# EAGLE design FAL65816_cpua (EAGLE 7.2.0)
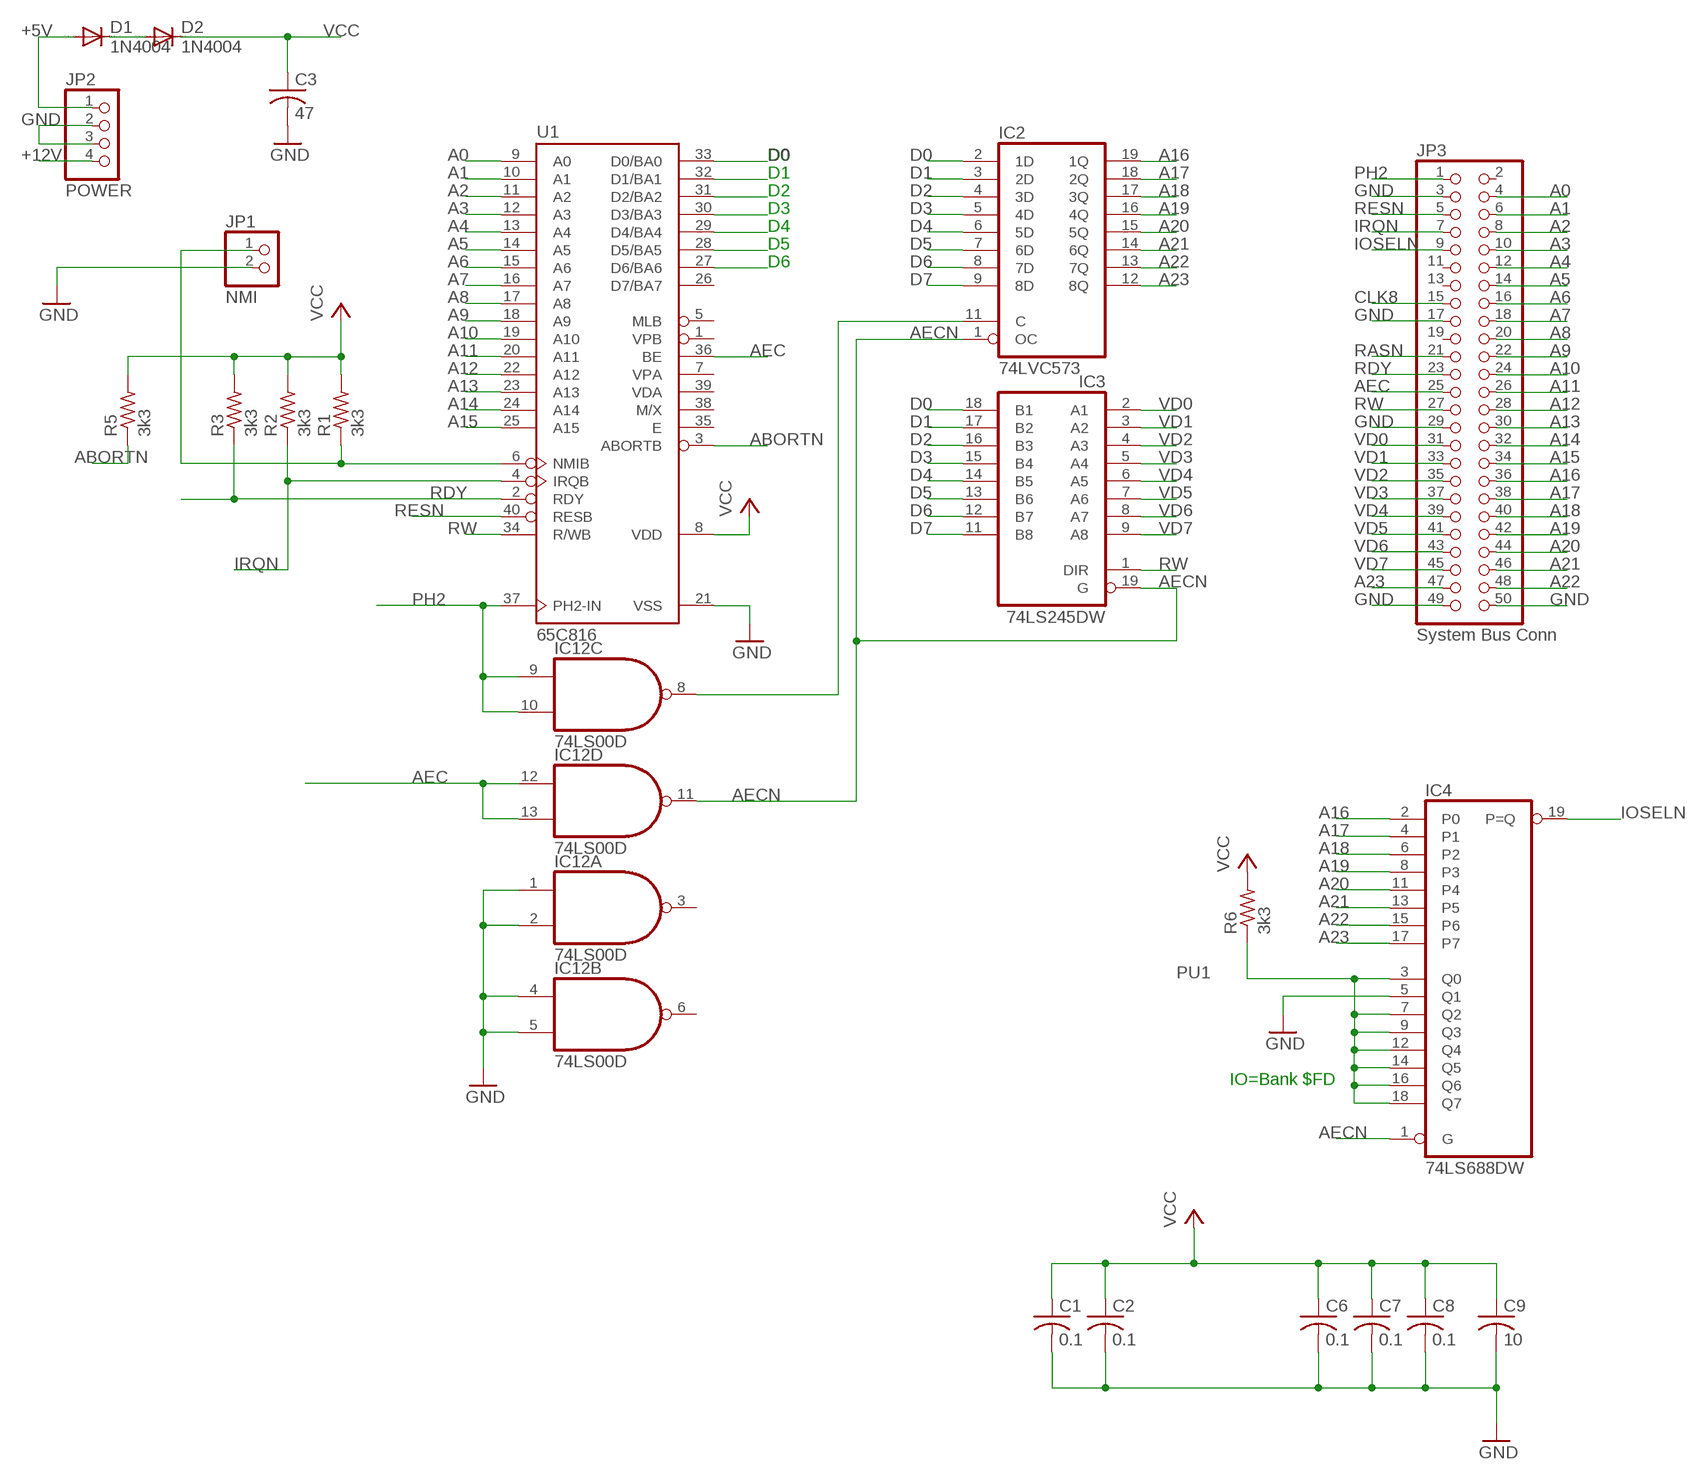
[diagram p0: schematic, sheet 1]

## Parts
C1  0.1  C-US050-024X044  [C050-024X044]
C2  0.1  C-US050-024X044  [C050-024X044]
C3  47  C-US050-024X044  [C050-024X044]
C6  0.1  C-US050-024X044  [C050-024X044]
C7  0.1  C-US050-024X044  [C050-024X044]
C8  0.1  C-US050-024X044  [C050-024X044]
C9  10  C-US050-024X044  [C050-024X044]
D1  1N4004  [DO41-10]
D2  1N4004  [DO41-10]
IC2  74LVC573  [SO20W]
IC3  74LS245DW  [SO20W]
IC4  74LS688DW  [SO20W]
IC12  74LS00D  [SO14]
JP1  NMI  PINHD-1X2  [1X02]
JP2  POWER  PINHD-1X4/90  [1X04/90]
JP3  System Bus Conn  PINHD-2X25/90  [2X25/90]
R1  3k3  R-US_0207/10  [0207/10]
R2  3k3  R-US_0207/10  [0207/10]
R3  3k3  R-US_0207/10  [0207/10]
R5  3k3  R-US_0207/10  [0207/10]
R6  3k3  R-US_0204/7  [0204/7]
U1  65C816  W65C816SP  [DIP-40]

## Nets
+5V: D1.A JP2.1
+12V: JP2.4
A0: JP3.4 U1.9(A0)
A1: JP3.6 U1.10(A1)
A2: JP3.8 U1.11(A2)
A3: JP3.10 U1.12(A3)
A4: JP3.12 U1.13(A4)
A5: JP3.14 U1.14(A5)
A6: JP3.16 U1.15(A6)
A7: JP3.18 U1.16(A7)
A8: JP3.20 U1.17(A8)
A9: JP3.22 U1.18(A9)
A10: JP3.24 U1.19(A10)
A11: JP3.26 U1.20(A11)
A12: JP3.28 U1.22(A12)
A13: JP3.30 U1.23(A13)
A14: JP3.32 U1.24(A14)
A15: JP3.34 U1.25(A15)
A16: IC2.19(1Q) IC4.2(P0) JP3.36
A17: IC2.18(2Q) IC4.4(P1) JP3.38
A18: IC2.17(3Q) IC4.6(P2) JP3.40
A19: IC2.16(4Q) IC4.8(P3) JP3.42
A20: IC2.15(5Q) IC4.11(P4) JP3.44
A21: IC2.14(6Q) IC4.13(P5) JP3.46
A22: IC2.13(7Q) IC4.15(P6) JP3.48
A23: IC2.12(8Q) IC4.17(P7) JP3.47
ABORTN: R5.1 U1.3(ABORTB)
AEC: IC12.12(D:I0) IC12.13(D:I1) JP3.25 U1.36(BE)
AECN: IC2.1(OC) IC3.19(G) IC4.1(G) IC12.11(D:O)
CLK8: JP3.15
D0: IC2.2(1D) IC3.18(B1) U1.33(D0/BA0)
D1: IC2.3(2D) IC3.17(B2) U1.32(D1/BA1)
D2: IC2.4(3D) IC3.16(B3) U1.31(D2/BA2)
D3: IC2.5(4D) IC3.15(B4) U1.30(D3/BA3)
D4: IC2.6(5D) IC3.14(B5) U1.29(D4/BA4)
D5: IC2.7(6D) IC3.13(B6) U1.28(D5/BA5)
D6: IC2.8(7D) IC3.12(B7) U1.27(D6/BA6)
D7: IC2.9(8D) IC3.11(B8)
GND: C1.2 C2.2 C3.2 C6.2 C7.2 C8.2 C9.2 IC4.5(Q1) IC12.1(A:I0) IC12.2(A:I1) IC12.4(B:I0) IC12.5(B:I1) JP1.2 JP2.2 JP2.3 JP3.3 JP3.17 JP3.29 JP3.49 JP3.50 U1.21(VSS)
IOSELN: IC4.19(P=Q) JP3.9
IRQN: JP3.7 R2.1 U1.4(IRQB)
N$1: JP1.1 R1.1 U1.6(NMIB)
N$3: IC2.11(C) IC12.8(C:O)
N$5: D1.C D2.A
PH2: IC12.9(C:I0) IC12.10(C:I1) JP3.1 U1.37(PH2-IN)
PU1: IC4.3(Q0) IC4.7(Q2) IC4.9(Q3) IC4.12(Q4) IC4.14(Q5) IC4.16(Q6) IC4.18(Q7) R6.1
RASN: JP3.21
RDY: JP3.23 R3.1 U1.2(RDY)
RESN: JP3.5 U1.40(RESB)
RW: IC3.1(DIR) JP3.27 U1.34(R/WB)
VCC: C1.1 C2.1 C3.1 C6.1 C7.1 C8.1 C9.1 D2.C R1.2 R2.2 R3.2 R5.2 R6.2 U1.8(VDD)
VD0: IC3.2(A1) JP3.31
VD1: IC3.3(A2) JP3.33
VD2: IC3.4(A3) JP3.35
VD3: IC3.5(A4) JP3.37
VD4: IC3.6(A5) JP3.39
VD5: IC3.7(A6) JP3.41
VD6: IC3.8(A7) JP3.43
VD7: IC3.9(A8) JP3.45
Unconnected: IC12.3(A:O) IC12.6(B:O) JP3.2 JP3.11 JP3.13 JP3.19 U1.1(VPB) U1.5(MLB) U1.7(VPA) U1.26(D7/BA7) U1.35(E) U1.38(M/X) U1.39(VDA)

## Notes on the sheet
- IO=Bank $FD

## Power pins joined to a net without a drawn wire
GND: IC2.10(GND) IC3.10(GND) IC4.10(GND) IC12.7(P:GND)
VCC: IC2.20(VCC) IC3.20(VCC) IC4.20(VCC) IC12.14(P:VCC)

## Library data of the parts
C1-C3 C6-C9 = rcl:C-US: CAPACITOR, American symbol
D1 D2 = diode:1N4004: DIODE general purpose rectifier, 1 A
IC2 = FT74xx:74*573: 8-bit D latch BUS DRIVER
IC3 = FT74xx:74*245: Octal BUS TRANSCEIVER, 3-state
IC4 = FT74xx:74*688: 8-bit MAGNITUDE/IDENTITY COMPARATOR, totem pole
IC12 = 74xx-us:74*00: Quad 2-input NAND gate
JP1 = pinhead:PINHD-1X2: PIN HEADER
JP2 = pinhead:PINHD-1X4: PIN HEADER
JP3 = pinhead:PINHD-2X25: PIN HEADER
R1-R3 R5 R6 = resistor:R-US_: RESISTOR, American symbol
U1 = 65xxx:W65C816SP: Wetern Digital Version

## Board
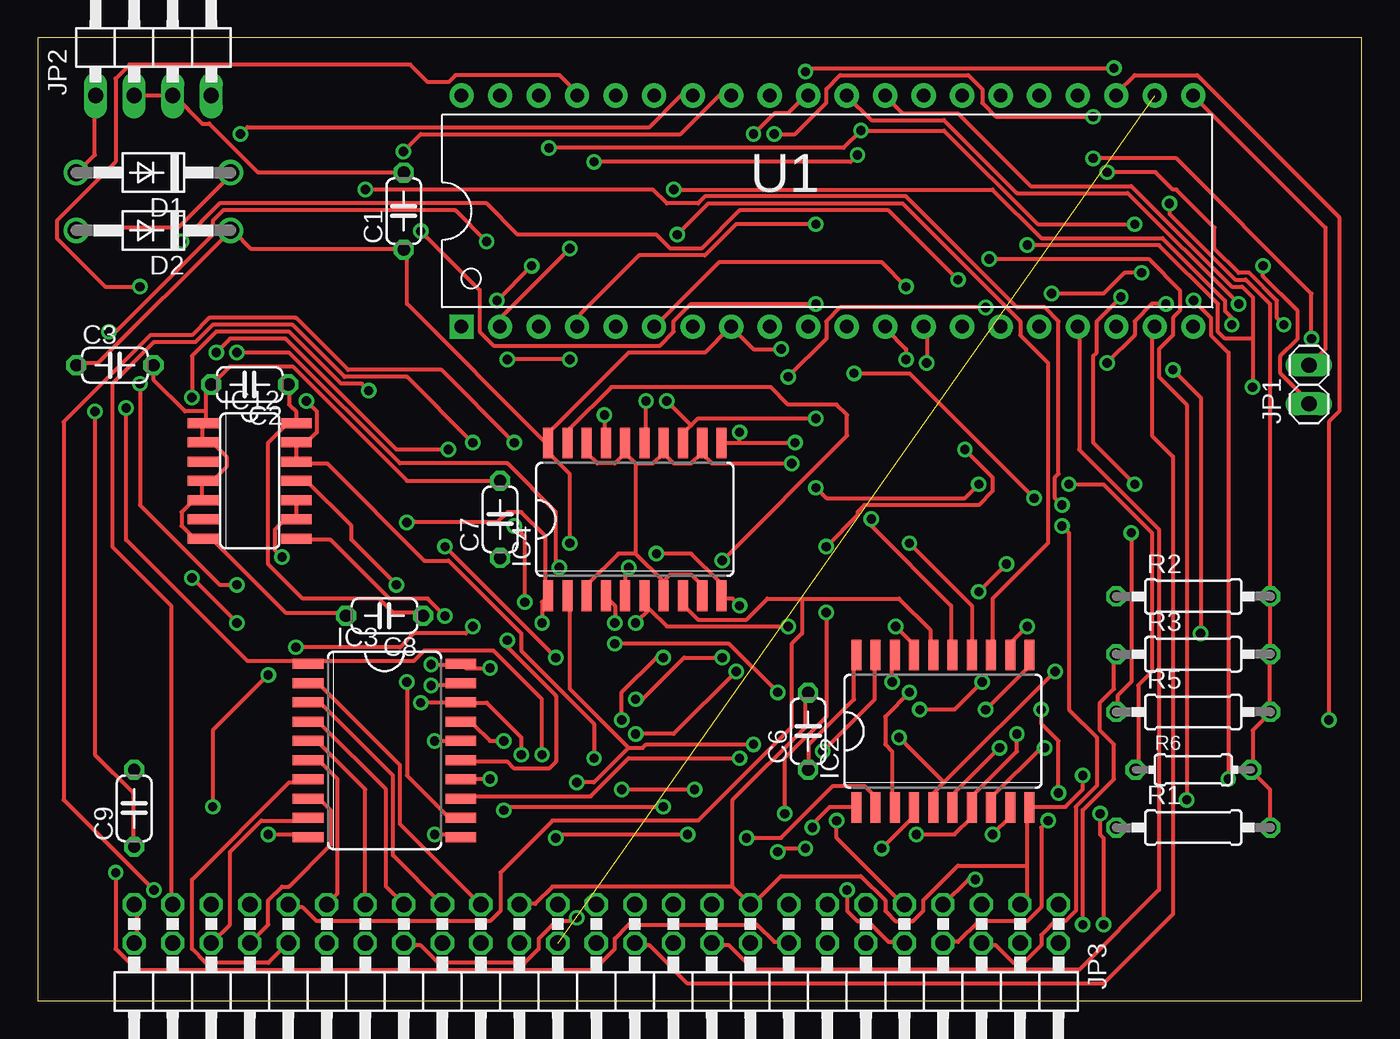
[diagram p1: board, top side]
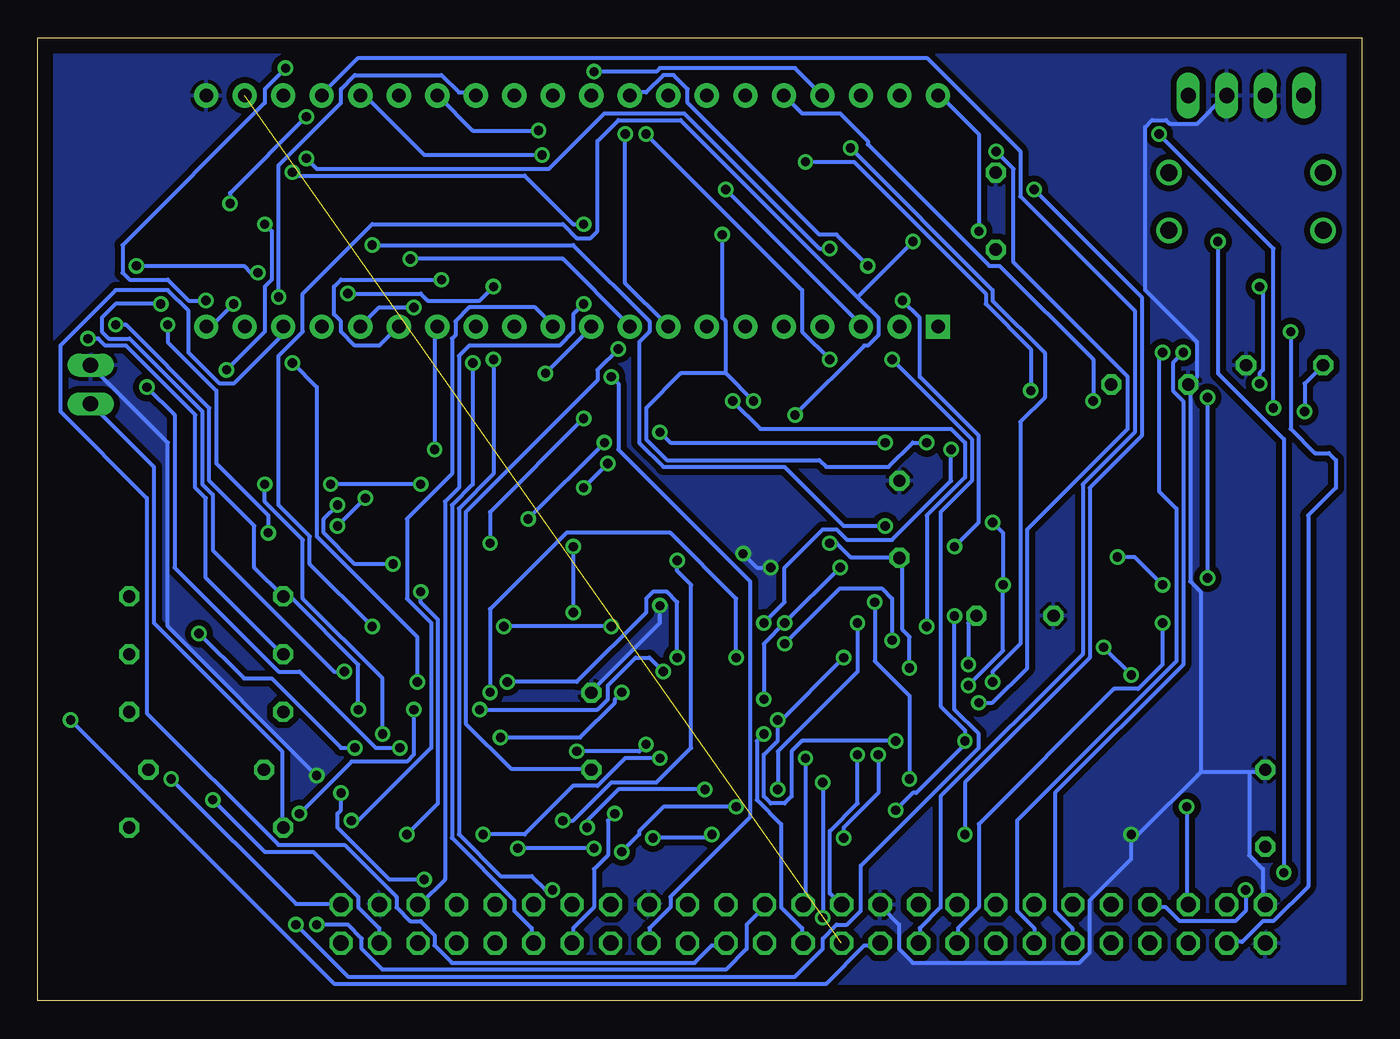
[diagram p2: board, bottom side, seen from below]

Size 87.3 x 63.49 mm. Coordinates in mm from the lower left corner, seen from the top.
Outline: 0,0 87.3,0 87.3,63.49 0,63.49 0,0
Copper layers (1*16): Top 0.035mm / dielectric 1.5mm / Bottom 0.035mm
Design rules "default": minimum track width 10mil, minimum drill 24mil, track to track 8mil, track to pad 8mil, pad to pad 8mil, via to via 8mil, smd to smd 8mil, copper to edge 40mil, drill to drill 8mil, minimum pad ring 10mil, minimum via ring 8mil, stop-mask expansion 4mil, vias tented up to drill 0mil, thermal gap 10mil

### Footprints (pad centres in the part's own frame; a part is rotated, then mirrored left to right if it is on the bottom)
C050-024X044 = drill 0.813 octagon: 1 -2.54,0; 2 2.54,0
DO41-10 = drill 1.118: A 5.08,0; C -5.08,0
SO20W = smd 0.66 x 2.032: 1 -5.715,-5.029; 2 -4.445,-5.029; 3 -3.175,-5.029; 4 -1.905,-5.029; 5 -0.635,-5.029; 6 0.635,-5.029; 7 1.905,-5.029; 8 3.175,-5.029; 9 4.445,-5.029; 10 5.715,-5.029; 11 5.715,5.029; 12 4.445,5.029; 13 3.175,5.029; 14 1.905,5.029; 15 0.635,5.029; 16 -0.635,5.029; 17 -1.905,5.029; 18 -3.175,5.029; 19 -4.445,5.029; 20 -5.715,5.029
SO14 = smd 0.66 x 2.032: 1 -3.81,-3.073; 2 -2.54,-3.073; 3 -1.27,-3.073; 4 0,-3.073; 5 1.27,-3.073; 6 2.54,-3.073; 7 3.81,-3.073; 8 3.81,3.073; 9 2.54,3.073; 10 1.27,3.073; 11 0,3.073; 12 -1.27,3.073; 13 -2.54,3.073; 14 -3.81,3.073
1X02 = drill 1.016 long: 1 -1.27,0; 2 1.27,0
1X04/90 = drill 1.016 long: 1 -3.81,-3.81; 2 -1.27,-3.81; 3 1.27,-3.81; 4 3.81,-3.81
2X25/90 = drill 1.016 octagon: 1 -29.21,-6.35; 2 -29.21,-3.81; 3 -26.67,-6.35; 4 -26.67,-3.81; 5 -24.13,-6.35; 6 -24.13,-3.81; 7 -21.59,-6.35; 8 -21.59,-3.81; 9 -19.05,-6.35; 10 -19.05,-3.81; 11 -16.51,-6.35; 12 -16.51,-3.81; 13 -13.97,-6.35; 14 -13.97,-3.81; 15 -11.43,-6.35; 16 -11.43,-3.81; 17 -8.89,-6.35; 18 -8.89,-3.81; 19 -6.35,-6.35; 20 -6.35,-3.81; 21 -3.81,-6.35; 22 -3.81,-3.81; 23 -1.27,-6.35; 24 -1.27,-3.81; 25 1.27,-6.35; 26 1.27,-3.81; 27 3.81,-6.35; 28 3.81,-3.81; 29 6.35,-6.35; 30 6.35,-3.81; 31 8.89,-6.35; 32 8.89,-3.81; 33 11.43,-6.35; 34 11.43,-3.81; 35 13.97,-6.35; 36 13.97,-3.81; 37 16.51,-6.35; 38 16.51,-3.81; 39 19.05,-6.35; 40 19.05,-3.81; 41 21.59,-3.81; 42 21.59,-6.35; 43 24.13,-3.81; 44 24.13,-6.35; 45 26.67,-3.81; 46 26.67,-6.35; 47 29.21,-3.81; 48 29.21,-6.35; 49 31.75,-3.81; 50 31.75,-6.35
0207/10 = drill 0.813 octagon: 1 -5.08,0; 2 5.08,0
0204/7 = drill 0.813 octagon: 1 -3.81,0; 2 3.81,0
DIP-40 = drill 0.889 pad 1.6 square: 1 -22.86,-7.62 | drill 0.889 pad 1.6: 2 -20.32,-7.62; 3 -17.78,-7.62; 4 -15.24,-7.62; 5 -12.7,-7.62; 6 -10.16,-7.62; 7 -7.62,-7.62; 8 -5.08,-7.62; 9 -2.54,-7.62; 10 0,-7.62; 11 2.54,-7.62; 12 5.08,-7.62; 13 7.62,-7.62; 14 10.16,-7.62; 15 12.7,-7.62; 16 15.24,-7.62; 17 17.78,-7.62; 18 20.32,-7.62; 19 22.86,-7.62; 20 25.4,-7.62; 21 25.4,7.62; 22 22.86,7.62; 23 20.32,7.62; 24 17.78,7.62; 25 15.24,7.62; 26 12.7,7.62; 27 10.16,7.62; 28 7.62,7.62; 29 5.08,7.62; 30 2.54,7.62; 31 0,7.62; 32 -2.54,7.62; 33 -5.08,7.62; 34 -7.62,7.62; 35 -10.16,7.62; 36 -12.7,7.62; 37 -15.24,7.62; 38 -17.78,7.62; 39 -20.32,7.62; 40 -22.86,7.62

### Placement (x,y rotation side)
C1  24.13,52.07 90 top
C2  13.97,40.64 180 top
C3  5.08,41.91 0 top
C6  50.8,17.78 90 top
C7  30.48,31.75 90 top
C8  22.86,25.4 180 top
C9  6.35,12.7 90 top
D1  7.62,54.61 180 top
D2  7.62,50.8 180 top
IC2  59.69,17.78 0 top
IC3  22.86,16.51 270 top
IC4  39.37,31.75 0 top
IC12  13.97,34.29 270 top
JP1  83.82,40.64 90 top
JP2  7.62,63.5 0 top
JP3  38.1,0 180 top
R1  76.2,11.43 0 top
R2  76.2,26.67 0 top
R3  76.2,22.86 0 top
R5  76.2,19.05 0 top
R6  76.2,15.24 0 top
U1  50.8,52.07 0 top

### Tracks (layer width: path | path; a pad name or v marks a point on that pad's centre or on a via)
+5V
  Top 0.254: JP2.1 3.76,59.66 3.76,55.78 2.62,54.63 D1.A
A0  (via drill 0.61)
  Top 0.254: v75.77,13.26 75.77,39.32 73.94,41.15 73.94,42.98 74.85,43.89 74.85,45.03 75.31,45.49 75.31,46.86 73.25,48.92 v62.74,48.92
  Bottom 0.254: v75.77,13.26 72.34,9.83 69.14,9.83 66.17,6.86 66.17,6.17 64.8,4.8 64.8,3.89 JP3.4 | v62.74,48.92 52.68,48.92 48.34,44.58 U1.9
A1  (via drill 0.61)
  Top 0.254: v67.54,31.32 68,30.86 68,19.2 69.83,17.37 69.83,14.17 68.45,12.8 68.45,5.94 67.77,5.26 67.08,5.26 66.17,4.34 66.17,3.66 65.02,2.52 64.34,2.52 63.19,3.66 62.28,3.66 JP3.6 | v65.71,33.15 57.48,41.38 v53.82,41.38
  Bottom 0.254: v65.71,33.15 v67.54,31.32 | v53.82,41.38 50.85,44.35 U1.10
A2  (via drill 0.61)
  Top 0.254: v66.62,11.89 66.17,11.43 66.17,6.17 65.25,5.26 62.05,5.26 60.68,3.89 59.77,3.89 JP3.8
  Bottom 0.254: v66.62,11.89 66.17,11.89 61.37,16.69 61.37,24.92 62.97,26.52 62.97,31.77 59.99,34.75 59.99,43.66 59.77,43.89 59.77,44.81 58.85,45.72 54.51,45.72 53.36,44.58 U1.11
A3  (via drill 0.61)
  Top 0.254: v53.36,7.32 53.36,5.94 54.05,5.26 54.74,5.26 56.11,3.89 57.02,3.89 JP3.10 | v57.25,42.29 57.25,42.98 55.88,44.35 U1.12
  Bottom 0.254: v53.36,7.32 53.82,7.32 54.74,8.23 56.79,8.23 59.54,10.97 59.54,32.46 57.25,34.75 v57.25,42.29
A4  (via drill 0.61)
  Top 0.254: v58.62,42.06 58.62,44.35 U1.13
  Bottom 0.254: v58.62,42.06 58.62,34.06 59.99,32.69 59.99,10.74 55.88,6.63 55.88,5.94 54.74,4.8 54.74,3.89 JP3.12
A5  (via drill 0.61)
  Top 0.254: v49.25,12.34 49.25,16 51.99,18.75 v51.99,25.6 | v51.99,29.95 54.05,32 54.05,32.23 54.51,32.69 62.05,32.69 62.97,33.6 62.97,34.52 v61.14,36.35
  Bottom 0.254: v49.25,12.34 49.71,11.89 49.71,9.6 50.62,8.69 50.62,6.17 51.99,4.8 51.99,3.89 JP3.14 | v51.99,29.95 v51.99,25.6 | v61.14,36.35 61.14,44.35 U1.14
A6  (via drill 0.61)
  Top 0.254: v5.13,8.46 5.13,3.43 6.5,2.06 36.68,2.06 38.05,3.43 38.05,4.12 38.96,5.03 47.42,5.03 48.56,3.89 49.48,3.89 JP3.16 | v9.47,50.06 11.99,52.58 29.59,52.58 31.65,50.52 40.79,50.52 41.71,49.61 43.76,49.61 46.28,52.12 56.11,52.12 v60.68,47.55
  Bottom 0.254: v5.13,8.46 5.13,37.03 9.47,41.38 v9.47,50.06 | v60.68,47.55 67.31,47.55 67.77,47.09 67.77,45.26 67.31,44.81 67.31,44.12 66.4,43.2 64.8,43.2 63.65,44.35 U1.15
A7  (via drill 0.61)
  Top 0.254: v49.48,41.15 51.99,43.66 51.99,44.81 52.91,45.72 v62.51,45.72
  Bottom 0.254: v49.48,41.15 49.02,40.69 49.02,36.35 40.33,27.66 40.33,12.12 45.59,6.86 45.59,6.17 46.97,4.8 46.97,3.89 JP3.18 | v62.51,45.72 64.8,45.72 65.94,44.58 U1.16
A8
  Top 0.254: JP3.20 44.45,3.66 45.59,3.66 47.19,2.06 68.68,2.06 73.94,7.32 73.94,31.09 68.68,36.35 68.68,44.35 U1.17
A9
  Bottom 0.254: JP3.22 41.94,3.66 42.85,3.66 43.99,2.52 59.99,2.52 61.14,3.66 61.14,4.34 62.05,5.26 62.74,5.26 63.65,6.17 63.65,6.86 67.08,10.29 71.42,10.29 80.11,18.97 80.11,33.15 85.83,38.86 85.83,43.2 82.17,46.86 78.74,46.86 77.37,45.49 77.37,42.75 75.31,40.69 74.4,40.69 71.2,43.89 71.2,44.35 U1.18
A10
  Top 0.254: JP3.24 39.42,3.66 40.33,3.66 42.85,1.14 70.28,1.14 74.85,5.71 74.85,35.89 73.48,37.26 73.48,44.35 U1.19
A11  (via drill 0.61)
  Top 0.254: v39.42,17.6 41.94,17.6 v46.05,21.72 | v58.17,19.2 60.45,19.2 v62.28,21.03 | v70.51,42.06 72.34,43.89 72.34,44.81 73.48,45.95 v74.4,45.95
  Bottom 0.254: v39.42,17.6 39.88,17.14 39.88,13.26 38.28,11.66 38.28,6.17 36.91,4.8 36.91,3.89 JP3.26 | v46.05,21.72 46.97,22.63 47.88,22.63 49.71,20.8 49.71,19.89 50.39,19.2 v58.17,19.2 | v62.28,21.03 62.28,24 68.91,30.63 68.91,40.46 v70.51,42.06 | v74.4,45.95 76,44.35 U1.20
A12  (1 unrouted)
A13  (via drill 0.61)
  Top 0.254: v85.14,18.52 85.14,38.18 85.83,38.86 85.83,51.66 76.45,61.04 72.34,61.04 71.2,59.89 U1.23
  Bottom 0.254: v85.14,18.52 67.77,1.14 35.31,1.14 32.79,3.66 31.88,3.66 JP3.30
A14
  Bottom 0.254: JP3.32 29.13,3.89 29.13,4.8 27.76,6.17 27.76,13.49 18.39,22.86 18.39,34.06 14.96,37.49 14.96,45.49 22.5,53.03 22.5,56.01 28.68,62.18 66.17,62.18 68.45,59.89 U1.24
A15  (via drill 0.61)
  Top 0.254: v10.16,27.89 v13.13,24.92 | v10.16,39.78 10.16,42.52 11.76,44.12 16.56,44.12 19.99,40.69 21.36,40.69 v21.82,40.23 | v36.68,55.32 53.59,55.32 v54.05,55.78
  Bottom 0.254: v13.13,24.92 13.13,22.17 14.73,20.57 16.33,20.57 25.25,11.66 25.25,6.17 26.62,4.8 26.62,3.89 JP3.34 | v10.16,39.78 v10.16,27.89 | v21.82,40.23 21.82,42.98 24.79,45.95 24.79,46.63 33.48,55.32 v36.68,55.32 | v54.05,55.78 61.82,55.78 65.94,59.89 U1.25
A16  (via drill 0.61)
  Top 0.254: v51.77,16.46 55.19,19.89 55.19,22.63 IC2.19 | v47.19,16.92 40.11,16.92 39.88,16.69 38.96,16.69 | 38.96,16.69 35.08,20.57 35.08,26.52 IC4.2 | v35.53,5.49 35.31,5.26 34.16,5.26 33.02,4.12 33.02,3.43 32.11,2.52 26.39,2.52 25.25,3.66 24.33,3.66 JP3.36 | v35.53,14.4 36.68,14.4 38.96,16.69
  Bottom 0.254: v51.77,16.46 47.65,16.46 v47.19,16.92 | v35.53,14.4 v35.53,5.49
A17  (via drill 0.61)
  Top 0.254: v56.34,21.03 56.34,22.63 IC2.18 | v45.14,22.63 42.62,22.63 39.88,19.89 v39.42,19.89 | v38.05,24.92 38.05,26.06 37.59,26.52 IC4.4 | v13.13,42.75 16.56,42.75 23.88,35.43 30.96,35.43 34.16,32.23 34.16,28.8 v34.39,28.57
  Bottom 0.254: v56.34,21.03 51.77,21.03 47.19,25.6 47.19,26.52 46.74,26.98 45.82,26.98 45.14,26.29 v45.14,22.63 | v39.42,19.89 39.42,23.55 v38.05,24.92 v34.39,28.57 | JP3.38 21.59,4.8 22.73,5.94 22.73,11.89 12.22,22.4 12.22,32.46 13.36,33.6 13.36,42.52 v13.13,42.75
A18  (via drill 0.61)
  Top 0.254: v56.57,24.69 57.71,23.55 57.71,22.86 IC2.17 | v49.48,24.69 41.48,24.69 40.33,25.83 | 40.33,25.83 40.11,26.06 40.11,26.52 IC4.6 | v11.76,42.75 12.68,43.66 16.33,43.66 23.65,36.35 v27.08,36.35 | 40.33,25.83 v39.42,24.92
  Bottom 0.254: v49.48,24.69 v56.57,24.69 | v11.76,42.75 12.45,42.06 12.45,40.23 11.76,39.55 11.76,22.17 20.22,13.72 20.22,5.94 19.07,4.8 19.07,3.89 JP3.40 | v27.08,36.35 27.08,34.29 30.96,30.4 33.93,30.4 34.62,31.09 35.53,31.09 38.05,28.57 38.05,26.29 v39.42,24.92
A19
  Top 0.254: 50.39,26.52 48.11,26.52 46.74,25.15 43.54,25.15 42.62,26.06 42.62,26.52 IC4.8 | 50.39,26.52 56.79,26.52 58.85,24.46 58.85,22.86 IC2.16 | 50.39,26.52 50.39,24.23 49.71,23.55 49.71,18.06 43.54,11.89 33.93,11.89 30.5,8.46 30.5,5.94 29.82,5.26 18.39,5.26 17.48,6.17 16.56,6.17 JP3.42
A20  (via drill 0.61)
  Top 0.254: v54.97,31.77 54.97,31.32 60.22,26.06 60.22,22.86 IC2.15 | 46.28,36.8 45.14,36.8 IC4.11 | 46.28,36.8 v49.94,36.8 | v7.64,7.32 1.7,13.26 1.7,38.18 7.42,43.89 10.16,43.89 11.3,45.03 17.02,45.03 20.45,41.6 26.62,41.6 v31.42,36.8 | 46.28,36.8 v46.28,37.49
  Bottom 0.254: v49.94,36.8 v54.97,31.77 | v7.64,7.32 7.64,5.94 8.33,5.26 11.99,5.26 12.9,6.17 13.82,6.17 JP3.44 | v31.42,36.8 45.59,36.8 v46.28,37.49
A21  (via drill 0.61)
  Top 0.254: IC2.14 61.59,26.06 v57.48,30.18 | v51.31,38.41 43.54,38.41 43.08,37.95 | 43.08,37.95 42.62,37.49 42.62,36.8 IC4.13 | v11.53,12.8 11.53,17.83 v15.19,21.49 | v17.02,23.32 23.88,23.32 24.79,24.23 28.22,24.23 v28.68,24.69 | 43.08,37.95 v41.48,39.55
  Bottom 0.254: v57.48,30.18 57.48,32.23 v51.31,38.41 | v11.53,12.8 11.53,6.4 JP3.46 | v17.02,23.32 v15.19,21.49 | v28.68,24.69 28.68,32 26.16,34.52 26.16,36.8 27.08,37.72 39.65,37.72 v41.48,39.55
A22  (via drill 0.61)
  Top 0.254: v42.16,50.52 44.22,52.58 57.02,52.58 64.8,44.81 64.8,43.89 66.62,42.06 66.62,30.18 62.97,26.52 62.97,22.86 IC2.13 | v40.11,39.55 40.11,36.8 IC4.15 | v28.68,36.8 24.33,41.15 20.22,41.15 16.79,44.58 11.53,44.58 10.39,43.43 7.64,43.43 4.9,40.69 4.9,29.95 8.79,26.06 8.79,6.4 JP3.48
  Bottom 0.254: v42.16,50.52 42.16,45.03 41.94,44.81 41.94,41.38 | v40.11,39.55 41.94,41.38 | v28.68,36.8 29.59,36.8 31.19,35.2 35.31,35.2 35.76,35.66 45.82,35.66 47.19,37.03 47.19,39.09 44.91,41.38 41.94,41.38
A23  (via drill 0.61)
  Top 0.254: v37.36,38.63 37.36,36.8 IC4.17 | v65.25,24.69 64.34,23.77 64.34,22.86 IC2.12 | v4.67,44.12 5.13,44.12 11.53,50.52 11.53,51.44 12.22,52.12 27.53,52.12 v29.59,50.06
  Bottom 0.254: v37.36,38.63 32.79,43.2 32.56,43.2 31.88,43.89 31.88,45.03 33.25,46.41 | 33.25,46.41 44.91,58.06 49.02,58.06 50.39,56.69 50.39,50.75 50.85,50.29 51.77,50.29 52.68,51.21 65.25,51.21 69.83,46.63 69.83,44.12 71.42,42.52 71.42,32.69 69.37,30.63 69.37,28.8 v65.25,24.69 | v4.67,44.12 4.67,37.72 3.07,36.12 2.16,36.12 1.7,35.66 1.7,33.83 3.53,32 3.53,7.54 5.82,5.26 6.5,5.26 7.87,3.89 8.79,3.89 JP3.47 | 33.25,46.41 v29.59,50.06
ABORTN  (via drill 0.61)
  Top 0.254: v72.11,30.86 72.11,21.03 71.2,20.12 71.2,19.2 R5.1 | v78.74,44.58 78.74,45.03 78.28,45.49 78.28,46.18 74.17,50.29 66.17,50.29 62.97,53.49 v41.94,53.49
  Bottom 0.254: v72.11,30.86 72.11,32 75.54,35.43 75.54,40.23 78.74,43.43 v78.74,44.58 | v41.94,53.49 33.02,44.58 U1.3
AEC  (via drill 0.61)
  Top 0.254: v17.7,39.55 18.39,38.86 18.39,37.49 17.93,37.03 17.25,37.03 IC12.13 17.02,36.8 17.02,35.66 IC12.12 17.25,35.43 19.07,35.43 25.48,29.03 27.08,29.03 31.88,24.23 31.88,23.09 36.68,18.29 v36.68,16
  Bottom 0.254: v17.7,39.55 17.7,42.29 23.88,48.46 24.56,48.46 32.56,56.46 32.56,56.69 34.39,58.52 36.91,58.52 38.05,59.66 U1.36 | v36.68,16 36.68,6.4 JP3.25
AECN  (via drill 0.61)
  Top 0.254: IC12.11 17.7,34.29 20.68,31.32 20.68,30.4 v23.65,27.43 | v25.93,20.8 27.76,20.8 IC3.19 | v51.08,11.43 51.08,11.66 52.22,12.8 53.82,12.8 IC2.1 | v38.51,13.95 v43.31,13.95 | v33.25,24.92 33.25,26.29 33.48,26.52 IC4.1 33.48,26.75 33.48,30.63 31.88,32.23 30.96,32.23 30.28,31.55 v24.33,31.55
  Bottom 0.254: v25.93,20.8 23.65,23.09 v23.65,27.43 23.65,30.86 v24.33,31.55 | v51.08,11.43 51.08,11.89 49.02,13.95 v43.31,13.95 | v38.51,13.95 38.51,16.46 33.25,21.72 v33.25,24.92
D0  (via drill 0.61)
  Top 0.254: v46.74,10.74 49.02,10.74 52.45,14.17 54.51,14.17 55.19,13.49 55.19,12.8 IC2.2 | v42.85,10.97 34.39,10.97 v34.16,10.74 | v31.88,16.23 31.88,17.37 29.59,19.66 27.99,19.66 IC3.18 27.76,19.66 v25.25,19.66 | v24.11,56.01 25.25,57.15 42.39,57.15 44.91,59.66 45.59,59.66 U1.33
  Bottom 0.254: v46.74,10.74 43.08,10.74 v42.85,10.97 | v34.16,10.74 34.16,11.43 31.88,13.72 v31.88,16.23 | v24.11,56.01 22.96,54.86 22.96,48.69 15.42,41.15 15.42,37.72 22.05,31.09 22.05,21.95 24.33,19.66 v25.25,19.66
D1  (via drill 0.61)
  Top 0.254: v57.48,20.34 55.88,18.75 55.88,16.92 56.34,16.46 56.34,12.8 IC2.3 | v41.25,22.63 40.79,22.63 38.51,20.34 v38.51,18.52 | v30.73,17.14 29.82,17.14 28.68,18.29 27.99,18.29 IC3.17 | v30.28,46.18 v32.56,48.46 | v34.16,22.63 v26.85,29.95
  Bottom 0.254: v57.48,20.34 57.48,25.83 52.45,30.86 45.59,30.86 41.25,26.52 v41.25,22.63 | 38.51,18.29 38.51,17.14 39.42,16.23 39.42,13.49 38.96,13.03 38.05,13.03 37.59,13.49 37.59,16.46 36.91,17.14 v30.73,17.14 | v32.56,48.46 34.62,50.52 35.76,50.52 44.45,59.21 44.45,60.12 45.36,61.04 46.05,61.04 47.19,59.89 48.11,59.89 U1.32 | v30.28,46.18 29.13,45.03 29.13,41.15 25.25,37.26 25.25,31.55 v26.85,29.95 | 38.51,18.29 v34.16,22.63 | 38.51,18.29 v38.51,18.52
D2  (via drill 0.61)
  Top 0.254: v26.16,17.14 IC3.16 | v35.08,42.29 v30.96,42.29 | v47.19,57.15 48.56,58.52 49.48,58.52 50.62,59.66 U1.31 | v55.65,10.06 57.71,12.12 57.71,12.57 IC2.4 | v50.62,10.06 49.02,10.06 v48.79,9.83 | v41.25,12.8 30.96,12.8 v30.73,12.57
  Bottom 0.254: v30.96,42.29 25.71,37.03 25.71,34.29 27.76,32.23 27.76,19.43 26.16,17.83 v26.16,17.14 26.16,16.92 29.36,13.72 29.59,13.72 v30.73,12.57 | v35.08,42.29 36.91,44.12 36.91,46.86 v47.19,57.15 | v50.62,10.06 v55.65,10.06 | v48.79,9.83 47.65,10.97 47.65,11.2 46.05,12.8 v41.25,12.8
D3  (via drill 0.61)
  Top 0.254: v67.08,21.72 59.77,14.4 | 59.77,14.4 59.08,13.72 59.08,12.8 IC2.5 | v79.2,45.95 71.88,53.26 64.57,53.26 59.77,58.06 54.97,58.06 U1.30 | v30.96,23.77 30.96,23.32 34.16,20.12 34.16,15.77 33.71,15.32 31.42,15.32 30.96,15.77 27.99,15.77 IC3.15 | v38.05,23.55 45.59,23.55 v48.79,20.34 | 59.77,14.4 v56.79,17.37
  Bottom 0.254: v67.08,21.72 67.77,21.72 75.77,29.72 75.77,33.38 76.45,34.06 76.45,38.86 81.25,43.66 82.63,43.66 83.08,44.12 83.08,45.03 82.17,45.95 v79.2,45.95 | v30.96,23.77 30.96,26.52 31.65,27.2 34.39,27.2 v38.05,23.55 | v48.79,20.34 49.25,19.89 49.25,19.66 51.54,17.37 v56.79,17.37
D4  (via drill 0.61)
  Top 0.254: v63.42,16.69 60.45,13.72 60.45,12.8 IC2.6 | 80.11,43.66 80.11,46.41 79.43,47.09 78.74,47.09 72.11,53.72 65.48,53.72 60.68,58.52 57.02,58.52 55.88,59.66 U1.29 | 80.11,43.66 v80.11,40.46 | v29.82,14.63 27.99,14.63 IC3.14 | v32.11,26.29 32.11,30.63 v31.42,31.32 | v65.25,49.84 73.94,49.84 77.83,45.95 77.83,44.12 78.28,43.66 80.11,43.66
  Bottom 0.254: v63.42,16.69 65.02,16.69 70.05,21.72 71.42,21.72 78.28,28.57 78.28,38.63 v80.11,40.46 | v29.82,14.63 29.82,20.12 32.11,22.4 v32.11,26.29 | v31.42,31.32 34.16,31.32 38.05,35.2 46.05,35.2 47.65,36.8 47.65,43.43 46.97,44.12 46.97,44.81 51.99,49.84 v65.25,49.84
D5  (via drill 0.61)
  Top 0.254: v57.94,10.97 60.45,10.97 61.59,12.12 IC2.7 61.59,13.49 64.57,16.46 v64.57,17.6 | v46.28,16 38.96,16 36.45,13.49 27.99,13.49 IC3.13 | v71.42,46.41 69.83,44.81 69.83,42.75 69.6,42.52 69.6,36.8 v72.34,34.06
  Bottom 0.254: v57.94,10.97 55.19,10.97 51.99,14.17 50.39,14.17 48.56,16 v46.28,16 | v71.42,46.41 71.42,55.09 67.31,59.21 67.31,60.12 66.4,61.04 60.68,61.04 59.54,59.89 58.62,59.89 U1.28 | v72.34,34.06 72.34,32.92 69.83,30.4 69.83,26.52 64.57,21.26 v64.57,17.6
D6  (via drill 0.61)
  Top 0.254: v24.33,21.03 24.33,14.86 27.08,12.12 27.76,12.12 IC3.12 | v33.71,56.24 53.14,56.24 v54.28,57.38 59.77,57.38 65.94,51.21 v72.34,51.21 | v66.4,16.69 66.17,16.69 62.97,13.49 62.97,12.8 IC2.8 | v76.68,24.23 76.68,39.78 v74.85,41.6
  Bottom 0.254: v24.33,21.03 24.33,21.72 22.5,23.55 22.5,38.18 20.9,39.78 20.9,42.75 24.33,46.18 24.33,46.86 v33.71,56.24 | v54.28,57.38 58.62,57.38 60.91,59.66 U1.27 | v66.4,16.69 67.31,16.69 71.88,21.26 73.71,21.26 v76.68,24.23 | v74.85,41.6 72.34,44.12 72.34,47.09 71.88,47.55 71.88,50.75 v72.34,51.21
D7  (via drill 0.61)
  Top 0.254: v26.16,10.97 27.76,10.97 IC3.11 | v21.59,53.49 40.56,53.49 41.48,52.58 43.54,52.58 43.99,53.03 57.25,53.03 64.57,45.72 66.4,45.72 67.31,44.81 67.31,34.75 67.08,34.52 67.08,33.15 v67.54,32.69 | v62.05,26.98 v63.88,28.8 | v62.97,10.97 64.11,12.12 64.11,12.57 IC2.9
  Bottom 0.254: v26.16,10.97 26.16,14.4 17.93,22.63 17.93,33.83 14.5,37.26 14.5,46.41 v21.59,53.49 | v67.54,32.69 68.45,31.77 68.45,30.86 66.4,28.8 v63.88,28.8 | v62.05,26.98 62.05,26.29 60.91,25.15 60.91,13.03 v62.97,10.97
GND  (via drill 0.61)
  Top 0.254: C1.2 24.11,54.63 14.5,54.63 11.3,57.84 10.85,57.84 9.02,59.66 JP2.3 8.79,59.66 6.5,59.66 JP2.2 | JP3.49 6.5,3.89 6.5,6.17 JP3.50 | v15.19,10.97 17.7,10.97 IC3.10 | C8.2 20.22,25.6 16.33,25.6 11.53,30.4 11.07,30.4 IC12.7 10.85,30.63 10.16,30.63 9.47,31.32 9.47,32.23 10.16,32.92 10.85,32.92 IC12.5 10.85,33.15 10.85,34.29 IC12.4 11.53,34.29 12.45,35.2 12.45,35.89 11.53,36.8 11.07,36.8 IC12.2 10.85,37.03 10.85,37.95 IC12.1 11.07,38.18 11.07,38.86 | 11.07,38.86 11.07,40.23 11.3,40.46 C2.2 11.53,40.69 12.68,41.83 16.79,41.83 24.33,34.29 C7.2 | 11.07,38.86 9.7,38.86 7.64,40.92 7.64,41.83 C3.2 | U1.21 84.91,50.98 84.91,42.98 84,42.06 JP1.2 | 65.25,8.91 65.25,6.86 64.8,6.4 JP3.3 | 65.25,8.91 65.25,12.57 IC2.10 65.48,12.8 67.77,12.8 68.91,13.95 v68.91,14.86 | IC4.5 38.73,28.35 v38.96,28.57 | v40.79,29.49 43.08,29.49 44.91,27.66 44.91,26.75 IC4.10 45.14,26.52 45.82,26.52 v46.28,26.06 | 45.82,7.54 45.82,13.26 50.62,18.06 50.62,20.12 C6.2 | 45.82,7.54 46.97,6.4 JP3.17 47.19,6.4 49.02,8.23 54.28,8.23 55.88,6.63 55.88,5.94 56.57,5.26 57.71,5.26 58.39,5.94 58.39,6.63 60.68,8.91 65.25,8.91 | 45.82,7.54 33.93,7.54 32.79,6.4 31.88,6.4 JP3.29
  Bottom 0.254: 10.62,15.09 14.73,10.97 v15.19,10.97 15.19,9.37 17.93,6.63 17.93,3.2 18.62,2.52 29.59,2.52 30.5,3.43 30.5,5.03 31.65,6.17 JP3.29 | 7.42,15.09 6.5,15.09 C9.2 | 7.42,15.09 10.62,15.09 | 7.42,15.09 7.42,9.6 6.5,8.69 6.5,6.4 JP3.50 | 10.62,15.09 10.62,26.98 11.3,27.66 11.3,40.46 C2.2 11.3,40.69 10.85,41.15 10.85,43.43 14.28,46.86 14.28,57.61 13.82,58.06 12.9,58.06 12.68,57.84 10.85,57.84 9.02,59.66 JP2.3 | v38.96,28.57 39.88,28.57 v40.79,29.49 | v46.28,26.06 46.28,24.92 50.85,20.34 C6.2 | v68.91,14.86 78.74,24.69 78.74,36.8 83.77,41.83 JP1.2
  pour Bottom (isolate 0.406): 0,63.5 87.63,63.5 87.63,0 0,0
IOSELN  (via drill 0.61)
  Top 0.254: v45.14,29.03 53.36,37.26 53.36,38.63 52.68,39.32 49.48,39.32 48.34,40.46 37.82,40.46 35.08,37.72 35.08,36.8 IC4.19 | v52.68,11.89 52.68,10.74 57.02,6.4 JP3.9
  Bottom 0.254: v45.14,29.03 45.14,28.35 44.22,27.43 44.22,16.69 46.51,14.4 49.48,14.4 51.99,11.89 v52.68,11.89
IRQN  (via drill 0.61)
  Top 0.254: v66.17,19.2 66.17,18.29 67.31,17.14 v67.31,13.72 | v61.82,8 61.37,8 59.77,6.4 JP3.7 | v51.31,51.21 46.05,51.21 43.99,49.15 39.65,49.15 35.76,45.26 35.76,44.58 U1.4 | v70.51,54.63 73.71,54.63 74.85,53.49 75.08,53.49 77.6,50.98 77.6,49.61 79.2,48.01 79.88,48.01 81.71,46.18 81.71,45.03 v82.17,44.58
  Bottom 0.254: v66.17,19.2 66.17,22.17 70.51,26.52 70.97,26.52 R2.1 73.02,28.57 73.02,31.32 76,34.29 76,39.09 81.48,44.58 v82.17,44.58 | v67.31,13.72 67.31,12.57 67.54,12.34 67.54,11.43 64.11,8 v61.82,8 | v51.31,51.21 51.99,51.21 55.19,54.41 70.28,54.41 v70.51,54.63
N$1  (via drill 0.61)
  Top 0.254: v57.25,47.09 55.65,48.69 44.91,48.69 40.79,44.58 U1.6 | v66.85,46.63 70.28,46.63 71.65,48.01 v72.8,48.01 | v80.8,48.46 80.8,47.78 83.08,45.49 83.08,43.66 81.94,42.52 81.94,41.38 83.77,39.55 JP1.1
  Bottom 0.254: JP1.1 79.65,35.2 79.65,24.92 71.2,16.46 71.2,11.43 R1.1 | v57.25,47.09 58.17,46.18 61.59,46.18 62.05,46.63 v66.85,46.63 | v72.8,48.01 73.25,48.01 73.71,48.46 v80.8,48.46
N$3  (via drill 0.61)
  Top 0.254: v26.85,25.38 25.71,26.52 23.19,26.52 19.3,30.4 17.25,30.4 IC12.8 | v70.28,5.03 70.28,10.74 70.05,10.97 v70.05,12.34 | v62.51,19.2 65.25,21.95 65.25,22.63 IC2.11
  Bottom 0.254: v26.85,25.38 26.85,19.2 25.25,17.6 25.25,16.69 33.02,8.91 33.02,5.94 33.93,5.03 34.62,5.03 35.53,4.12 35.53,3.43 37.36,1.6 66.85,1.6 v70.28,5.03 | v70.05,12.34 66.62,15.77 62.97,15.77 62.51,16.23 v62.51,19.2
N$5
  Top 0.254: D2.A 2.62,50.98 9.25,50.98 12.68,54.41 D1.C
PH2  (via drill 0.61)
  Top 0.254: IC12.10 17.02,32.92 17.02,31.77 IC12.9 17.02,31.55 16.1,31.55 15.65,31.09 15.65,29.72 v16.1,29.26 | v13.13,27.43 11.99,27.43 6.73,32.69 v6.73,40.69 | v6.73,47.09 4.45,47.09 1.25,50.29 1.25,51.44 5.13,55.32 5.13,60.81 6.05,61.72 24.56,61.72 25.71,60.58 27.08,60.58 27.53,61.04 34.39,61.04 35.53,59.89 U1.37 | v78.51,14.63 78.51,42.75 77.37,43.89 77.37,45.03 v76.22,46.18 | v70.97,61.49 50.85,61.49 v50.62,61.27
  Bottom 0.254: v16.1,29.26 14.96,29.26 v13.13,27.43 | v6.73,40.69 6.73,41.38 6.5,41.6 6.5,46.86 v6.73,47.09 | v78.51,14.63 70.28,6.4 67.31,6.4 JP3.1 | v76.22,46.18 77.37,46.18 78.74,47.55 81.25,47.55 81.71,48.01 81.71,49.84 72.34,59.21 72.34,60.12 v70.97,61.49 | v50.62,61.27 46.51,61.27 46.28,61.49 37.36,61.49 U1.37
PU1  (via drill 0.61)
  Top 0.254: 39.42,29.49 38.28,29.49 36.22,27.43 36.22,26.75 IC4.3 | 41.25,27.66 39.42,29.49 | 41.25,27.66 41.25,26.75 IC4.7 41.25,27.66 | 41.25,27.66 41.71,28.12 43.08,28.12 43.76,27.43 43.76,26.75 IC4.9 | 38.73,36.12 38.05,35.43 36.91,35.43 36.22,36.12 36.22,36.58 IC4.18 | 38.73,36.12 IC4.16 38.73,36.58 | 41.25,36.12 41.25,36.58 IC4.14 41.25,36.12 | 41.25,36.12 40.56,35.43 39.42,35.43 | 38.73,36.12 39.42,35.43 | 43.76,36.12 43.76,36.58 IC4.12 43.76,36.12 | 43.76,36.12 43.08,35.43 41.94,35.43 41.25,36.12 | v68,34.06 70.28,34.06 73.48,30.86 73.48,21.72 72.57,20.8 72.57,15.32 R6.1 | v62.05,34.06 61.14,33.15 51.99,33.15 v51.31,33.83 | v49.71,35.43 44.45,35.43 43.76,36.12 | 39.42,35.43 39.42,29.49
  Bottom 0.254: v62.05,34.06 v68,34.06 | v49.71,35.43 v51.31,33.83
RDY  (via drill 0.61)
  Top 0.254: v68.91,5.03 68.91,12.57 70.97,14.63 70.97,16.92 70.05,17.83 70.05,19.66 70.97,20.57 70.97,22.86 R3.1 | v35.08,49.61 30.5,45.03 30.5,44.58 U1.2 | v69.6,55.55 75.08,55.55 84,46.63 v84,43.66
  Bottom 0.254: v68.91,5.03 66.85,5.03 65.94,4.12 65.94,3.43 64.57,2.06 41.94,2.06 40.56,3.43 40.56,5.03 39.42,6.17 JP3.23 | v35.08,49.61 35.76,49.61 44.68,58.52 49.94,58.52 53.59,54.86 68.91,54.86 v69.6,55.55 | v84,43.66 83.31,43.66 82.86,43.2 81.48,43.2 76.91,38.63 76.91,33.83 76.22,33.15 76.22,27.89 71.2,22.86 R3.1
RESN  (via drill 0.61)
  Top 0.254: v51.31,45.95 43.08,45.95 41.94,44.81 41.94,44.12 41.02,43.2 30.05,43.2 29.13,44.12 29.13,46.86 v25.25,50.75
  Bottom 0.254: v51.31,45.95 51.99,45.26 51.99,44.12 52.91,43.2 58.85,43.2 59.54,42.52 59.54,33.83 60.45,32.92 60.45,8 62.05,6.4 JP3.5 | v25.25,50.75 25.25,57.15 27.76,59.66 U1.40
RW  (via drill 0.61)
  Top 0.254: v33.25,16.23 33.25,19.89 30.05,23.09 25.48,23.09 24.79,22.4 17.93,22.4 IC3.1 17.7,22.4 13.82,22.4 5.82,30.4 v5.82,39.09 | v13.36,57.15 13.82,57.61 40.33,57.61 42.39,59.66 43.08,59.66 U1.34
  Bottom 0.254: v33.25,16.23 33.25,13.03 35.08,11.2 35.08,7.09 34.39,6.4 JP3.27 | v13.36,57.15 5.82,49.61 v5.82,39.09
VCC  (via drill 0.61)
  Top 0.254: v3.76,38.86 3.76,16.23 6.27,13.72 6.27,10.29 C9.1 | C3.1 2.62,42.06 3.99,42.06 12.68,50.75 D2.C 12.9,50.75 14.05,49.61 24.11,49.61 C1.1 24.33,49.38 24.33,45.95 33.48,36.8 IC4.20 | C2.1 16.56,40.46 16.56,39.32 17.02,38.86 17.02,38.18 IC12.14 17.02,37.95 16.33,37.95 15.19,36.8 15.19,28.8 17.48,26.52 22.5,26.52 23.42,25.6 25.25,25.6 C8.1 | v25.93,22.17 27.76,22.17 IC3.20 27.99,22.17 28.22,21.95 v29.82,21.95 | 81.25,22.86 81.25,26.52 R2.2 81.25,26.75 81.25,45.95 79.65,47.55 78.97,47.55 74.62,51.89 v74.62,52.58 | R1.2 81.25,11.43 81.25,13.95 80.11,15.09 R6.2 80.11,15.32 80.11,17.83 81.25,18.97 R5.2 81.25,19.2 81.25,22.86 | 81.25,22.86 R3.2 | IC2.20 53.82,22.63 53.82,19.89 50.85,16.92 50.85,15.32 C6.1 | IC4.20 33.71,36.8 33.71,37.49 38.96,42.75 43.99,42.75 45.59,44.35 U1.8 47.19,42.98 v49.02,42.98 | v69.6,58.29 63.19,58.29 62.28,59.21 62.28,60.12 61.37,61.04 52.91,61.04 51.99,60.12 51.99,59.21 49.94,57.15 v48.56,57.15 | v35.08,30.18 35.08,34.75 33.71,36.12 33.71,36.58 IC4.20
  Bottom 0.254: v3.76,38.86 3.76,40.69 C3.1 | v25.93,22.17 25.93,24.92 25.48,25.38 C8.1 | v29.82,21.95 29.82,24 30.28,24.46 30.28,29.03 C7.1 30.5,29.26 33.71,29.26 34.62,30.18 v35.08,30.18 | v49.02,42.98 50.39,41.6 50.39,40.92 59.08,32.23 59.08,18.29 56.11,15.32 50.85,15.32 C6.1 | v74.62,52.58 74.62,53.26 v69.6,58.29 | v48.56,57.15 48.56,47.32 45.82,44.58 U1.8
VD0
  Top 0.254: IC3.2 17.93,20.8 18.62,20.8 23.88,15.54 23.88,11.66 29.13,6.4 JP3.31
VD1
  Top 0.254: JP3.33 23.42,9.6 23.42,14.86 18.62,19.66 17.93,19.66 IC3.3
VD2
  Top 0.254: IC3.4 17.93,18.29 18.62,18.29 22.96,13.95 22.96,7.54 24.11,6.4 JP3.35
VD3
  Top 0.254: IC3.5 18.39,17.14 21.59,13.95 JP3.37
VD4
  Top 0.254: IC3.6 17.93,15.77 18.62,15.77 19.76,14.63 19.76,7.09 19.07,6.4 JP3.39
VD5
  Top 0.254: IC3.7 17.7,14.4 16.56,14.4 10.16,8 10.16,3.43 11.07,2.52 15.19,2.52 16.33,3.66 JP3.41
VD6
  Top 0.254: JP3.43 15.19,5.03 15.19,6.63 16.1,7.54 16.56,7.54 19.3,10.29 19.3,12.57 18.62,13.26 17.93,13.26 IC3.8
VD7
  Top 0.254: IC3.9 17.7,11.89 14.73,11.89 12.68,9.83 12.68,5.03 11.53,3.89 JP3.45